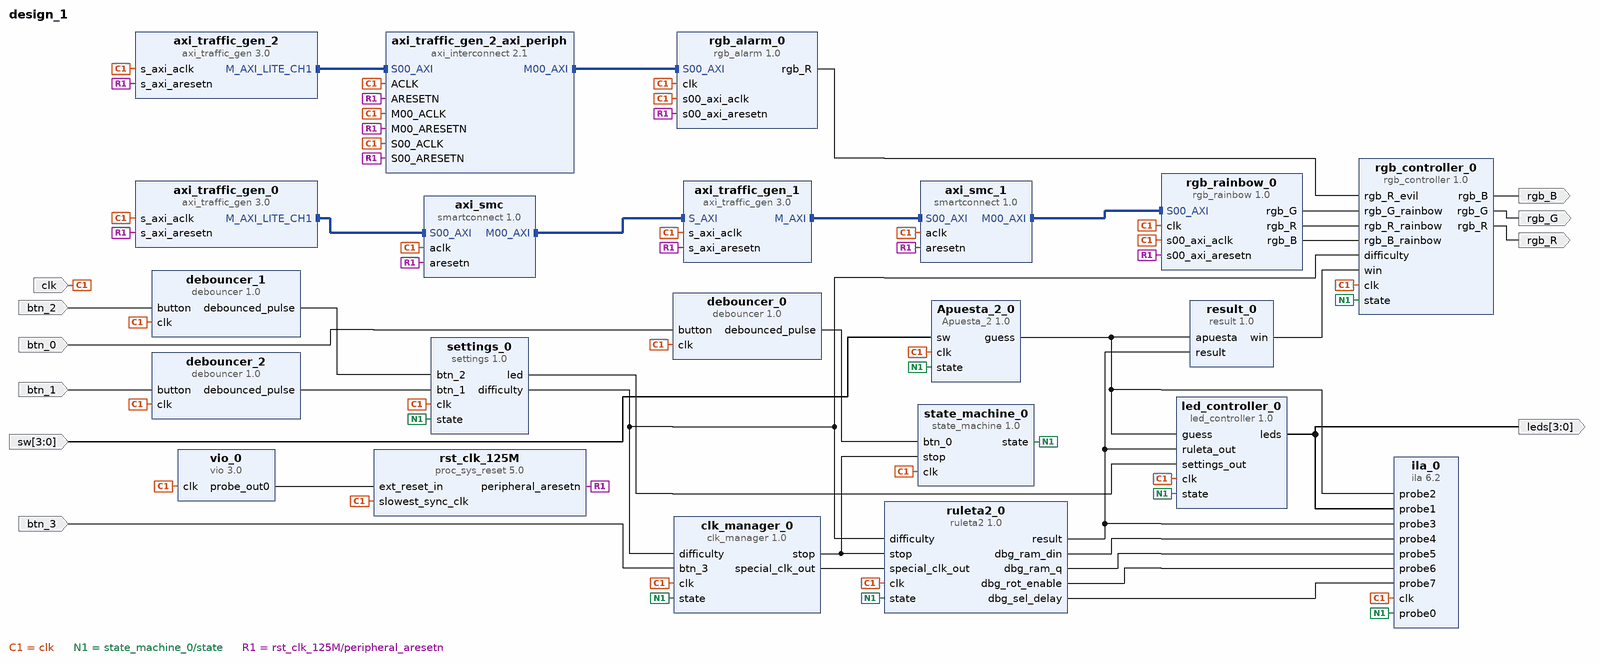
[diagram p0: block diagram of the top level]
# Vivado block design design_1, xc7z010clg400-1, Vivado 2020.1
create_bd_design design_1

create_bd_port -dir I -type clk clk
set_property -dict {CONFIG.FREQ_HZ 125000000} [get_bd_ports clk]
create_bd_port -dir I btn_1
create_bd_port -dir I btn_2
create_bd_port -dir I btn_0
create_bd_port -dir I btn_3
create_bd_port -dir O -from 3 -to 0 leds
create_bd_port -dir I -from 3 -to 0 sw
create_bd_port -dir O rgb_R
create_bd_port -dir O rgb_G
create_bd_port -dir O rgb_B

create_bd_cell -type ip -vlnv xilinx.com:user:state_machine:1.0 state_machine_0
create_bd_cell -type ip -vlnv xilinx.com:user:clk_manager:1.0 clk_manager_0
create_bd_cell -type ip -vlnv xilinx.com:user:settings:1.0 settings_0
create_bd_cell -type ip -vlnv xilinx.com:user:debouncer:1.0 debouncer_0
create_bd_cell -type ip -vlnv xilinx.com:user:debouncer:1.0 debouncer_1
create_bd_cell -type ip -vlnv xilinx.com:user:debouncer:1.0 debouncer_2
create_bd_cell -type ip -vlnv xilinx.com:ip:axi_traffic_gen:3.0 axi_traffic_gen_0
set_property -dict [list \
  CONFIG.C_ATG_MIF_DATA_DEPTH 64 \
  CONFIG.C_ATG_MODE AXI4-Lite \
  CONFIG.C_ATG_SYSINIT_MODES System_Test \
  CONFIG.C_ATG_SYSTEM_CMD_MAX_RETRY 2147483647 \
  CONFIG.C_ATG_SYSTEM_INIT_ADDR_MIF ../../../../../../../COE_Files/addr.coe \
  CONFIG.C_ATG_SYSTEM_INIT_CTRL_MIF ../../../../../../../COE_Files/ctrl.coe \
  CONFIG.C_ATG_SYSTEM_INIT_DATA_MIF ../../../../../../../COE_Files/data.coe \
  CONFIG.C_ATG_SYSTEM_INIT_MASK_MIF ../../../../../../../COE_Files/mask.coe \
] [get_bd_cells axi_traffic_gen_0]
create_bd_cell -type ip -vlnv xilinx.com:ip:axi_traffic_gen:3.0 axi_traffic_gen_1
create_bd_cell -type ip -vlnv xilinx.com:ip:smartconnect:1.0 axi_smc
set_property -dict {CONFIG.NUM_SI 1} [get_bd_cells axi_smc]
create_bd_cell -type ip -vlnv xilinx.com:ip:proc_sys_reset:5.0 rst_clk_125M
create_bd_cell -type ip -vlnv xilinx.com:ip:smartconnect:1.0 axi_smc_1
set_property -dict {CONFIG.NUM_SI 1} [get_bd_cells axi_smc_1]
create_bd_cell -type ip -vlnv xilinx.com:ip:vio:3.0 vio_0
set_property -dict {CONFIG.C_NUM_PROBE_IN 0} [get_bd_cells vio_0]
create_bd_cell -type ip -vlnv xilinx.com:ip:ila:6.2 ila_0
set_property -dict [list \
  CONFIG.C_ENABLE_ILA_AXI_MON false \
  CONFIG.C_MONITOR_TYPE Native \
  CONFIG.C_NUM_OF_PROBES 8 \
  CONFIG.C_PROBE0_WIDTH 2 \
  CONFIG.C_PROBE1_WIDTH 4 \
  CONFIG.C_PROBE2_WIDTH 4 \
  CONFIG.C_PROBE3_WIDTH 4 \
  CONFIG.C_PROBE4_WIDTH 4 \
  CONFIG.C_PROBE5_WIDTH 4 \
  CONFIG.C_PROBE7_WIDTH 2 \
] [get_bd_cells ila_0]
create_bd_cell -type ip -vlnv xilinx.com:ip:axi_traffic_gen:3.0 axi_traffic_gen_2
set_property -dict [list \
  CONFIG.C_ATG_MODE AXI4-Lite \
  CONFIG.C_ATG_SYSINIT_MODES System_Test \
  CONFIG.C_ATG_SYSTEM_CMD_MAX_RETRY 2147483647 \
  CONFIG.C_ATG_SYSTEM_INIT_ADDR_MIF ../../../../../../../COE_Files_2/addr.coe \
  CONFIG.C_ATG_SYSTEM_INIT_CTRL_MIF ../../../../../../../COE_Files_2/ctrl.coe \
  CONFIG.C_ATG_SYSTEM_INIT_DATA_MIF ../../../../../../../COE_Files_2/data.coe \
  CONFIG.C_ATG_SYSTEM_INIT_MASK_MIF ../../../../../../../COE_Files_2/mask.coe \
] [get_bd_cells axi_traffic_gen_2]
create_bd_cell -type ip -vlnv xilinx.com:ip:axi_interconnect:2.1 axi_traffic_gen_2_axi_periph
set_property -dict {CONFIG.NUM_MI 1} [get_bd_cells axi_traffic_gen_2_axi_periph]
create_bd_cell -type ip -vlnv xilinx.com:user:rgb_alarm:1.0 rgb_alarm_0
create_bd_cell -type ip -vlnv xilinx.com:user:result:1.0 result_0
create_bd_cell -type ip -vlnv xilinx.com:user:rgb_rainbow:1.0 rgb_rainbow_0
create_bd_cell -type ip -vlnv xilinx.com:user:led_controller:1.0 led_controller_0
create_bd_cell -type ip -vlnv xilinx.com:user:rgb_controller:1.0 rgb_controller_0
create_bd_cell -type ip -vlnv xilinx.com:user:Apuesta_2:1.0 Apuesta_2_0
create_bd_cell -type ip -vlnv xilinx.com:user:ruleta2:1.0 ruleta2_0

# ---- connections ----

connect_bd_intf_net [get_bd_intf_pins axi_traffic_gen_1/M_AXI] [get_bd_intf_pins axi_smc_1/S00_AXI]
connect_bd_intf_net [get_bd_intf_pins axi_traffic_gen_2_axi_periph/M00_AXI] [get_bd_intf_pins rgb_alarm_0/S00_AXI]
connect_bd_intf_net [get_bd_intf_pins axi_smc/M00_AXI] [get_bd_intf_pins axi_traffic_gen_1/S_AXI]
connect_bd_intf_net [get_bd_intf_pins axi_smc_1/M00_AXI] [get_bd_intf_pins rgb_rainbow_0/S00_AXI]
connect_bd_intf_net [get_bd_intf_pins axi_traffic_gen_0/M_AXI_LITE_CH1] [get_bd_intf_pins axi_smc/S00_AXI]
connect_bd_intf_net [get_bd_intf_pins axi_traffic_gen_2/M_AXI_LITE_CH1] [get_bd_intf_pins axi_traffic_gen_2_axi_periph/S00_AXI]
connect_bd_net -net clk_0_1 [get_bd_ports clk] \
  [get_bd_pins settings_0/clk] [get_bd_pins clk_manager_0/clk] [get_bd_pins state_machine_0/clk] \
  [get_bd_pins debouncer_2/clk] [get_bd_pins debouncer_1/clk] [get_bd_pins debouncer_0/clk] \
  [get_bd_pins axi_traffic_gen_0/s_axi_aclk] [get_bd_pins vio_0/clk] [get_bd_pins axi_traffic_gen_1/s_axi_aclk] \
  [get_bd_pins axi_smc/aclk] [get_bd_pins axi_smc_1/aclk] [get_bd_pins rst_clk_125M/slowest_sync_clk] [get_bd_pins ila_0/clk] \
  [get_bd_pins axi_traffic_gen_2/s_axi_aclk] [get_bd_pins axi_traffic_gen_2_axi_periph/S00_ACLK] \
  [get_bd_pins axi_traffic_gen_2_axi_periph/M00_ACLK] [get_bd_pins axi_traffic_gen_2_axi_periph/ACLK] \
  [get_bd_pins rgb_alarm_0/clk] [get_bd_pins rgb_alarm_0/s00_axi_aclk] [get_bd_pins rgb_rainbow_0/clk] \
  [get_bd_pins rgb_rainbow_0/s00_axi_aclk] [get_bd_pins led_controller_0/clk] [get_bd_pins rgb_controller_0/clk] \
  [get_bd_pins Apuesta_2_0/clk] [get_bd_pins ruleta2_0/clk]
connect_bd_net -net btn_3_0_1 [get_bd_ports btn_3] [get_bd_pins clk_manager_0/btn_3]
connect_bd_net [get_bd_pins state_machine_0/state] \
  [get_bd_pins clk_manager_0/state] [get_bd_pins settings_0/state] [get_bd_pins ila_0/probe0] \
  [get_bd_pins led_controller_0/state] [get_bd_pins rgb_controller_0/state] [get_bd_pins Apuesta_2_0/state] \
  [get_bd_pins ruleta2_0/state]
connect_bd_net [get_bd_pins led_controller_0/leds] [get_bd_ports leds] [get_bd_pins ila_0/probe1]
connect_bd_net -net apuesta_0_guess [get_bd_pins Apuesta_2_0/guess] \
  [get_bd_pins ila_0/probe2] [get_bd_pins result_0/apuesta] [get_bd_pins led_controller_0/guess]
connect_bd_net [get_bd_pins clk_manager_0/stop] [get_bd_pins state_machine_0/stop] [get_bd_pins ruleta2_0/stop]
connect_bd_net -net ruleta_0_result [get_bd_pins ruleta2_0/result] \
  [get_bd_pins ila_0/probe3] [get_bd_pins result_0/result] [get_bd_pins led_controller_0/ruleta_out]
connect_bd_net [get_bd_pins settings_0/difficulty] \
  [get_bd_pins clk_manager_0/difficulty] [get_bd_pins rgb_controller_0/difficulty] [get_bd_pins ruleta2_0/difficulty]
connect_bd_net -net btn_1_1 [get_bd_ports btn_1] [get_bd_pins debouncer_2/button]
connect_bd_net -net btn_2_1 [get_bd_ports btn_2] [get_bd_pins debouncer_1/button]
connect_bd_net -net btn_0_1 [get_bd_ports btn_0] [get_bd_pins debouncer_0/button]
connect_bd_net [get_bd_pins debouncer_0/debounced_pulse] [get_bd_pins state_machine_0/btn_0]
connect_bd_net [get_bd_pins debouncer_1/debounced_pulse] [get_bd_pins settings_0/btn_2]
connect_bd_net [get_bd_pins debouncer_2/debounced_pulse] [get_bd_pins settings_0/btn_1]
connect_bd_net [get_bd_pins rst_clk_125M/peripheral_aresetn] \
  [get_bd_pins axi_traffic_gen_0/s_axi_aresetn] [get_bd_pins axi_traffic_gen_1/s_axi_aresetn] [get_bd_pins axi_smc/aresetn] \
  [get_bd_pins axi_smc_1/aresetn] [get_bd_pins axi_traffic_gen_2/s_axi_aresetn] \
  [get_bd_pins axi_traffic_gen_2_axi_periph/S00_ARESETN] [get_bd_pins axi_traffic_gen_2_axi_periph/M00_ARESETN] \
  [get_bd_pins axi_traffic_gen_2_axi_periph/ARESETN] [get_bd_pins rgb_alarm_0/s00_axi_aresetn] \
  [get_bd_pins rgb_rainbow_0/s00_axi_aresetn]
connect_bd_net [get_bd_pins vio_0/probe_out0] [get_bd_pins rst_clk_125M/ext_reset_in]
connect_bd_net [get_bd_pins settings_0/led] [get_bd_pins led_controller_0/settings_out]
connect_bd_net [get_bd_pins rgb_controller_0/rgb_G] [get_bd_ports rgb_G]
connect_bd_net [get_bd_pins rgb_controller_0/rgb_R] [get_bd_ports rgb_R]
connect_bd_net [get_bd_pins rgb_controller_0/rgb_B] [get_bd_ports rgb_B]
connect_bd_net [get_bd_pins rgb_rainbow_0/rgb_G] [get_bd_pins rgb_controller_0/rgb_G_rainbow]
connect_bd_net [get_bd_pins rgb_rainbow_0/rgb_R] [get_bd_pins rgb_controller_0/rgb_R_rainbow]
connect_bd_net [get_bd_pins rgb_rainbow_0/rgb_B] [get_bd_pins rgb_controller_0/rgb_B_rainbow]
connect_bd_net [get_bd_pins rgb_alarm_0/rgb_R] [get_bd_pins rgb_controller_0/rgb_R_evil]
connect_bd_net [get_bd_pins result_0/win] [get_bd_pins rgb_controller_0/win]
connect_bd_net [get_bd_ports sw] [get_bd_pins Apuesta_2_0/sw]
connect_bd_net [get_bd_pins clk_manager_0/special_clk_out] [get_bd_pins ruleta2_0/special_clk_out]
connect_bd_net [get_bd_pins ruleta2_0/dbg_ram_din] [get_bd_pins ila_0/probe4]
connect_bd_net [get_bd_pins ruleta2_0/dbg_ram_q] [get_bd_pins ila_0/probe5]
connect_bd_net [get_bd_pins ruleta2_0/dbg_rot_enable] [get_bd_pins ila_0/probe6]
connect_bd_net [get_bd_pins ruleta2_0/dbg_sel_delay] [get_bd_pins ila_0/probe7]

# ---- address map ----
assign_bd_address -offset 0x44A00000 -range 64K -target_address_space [get_bd_addr_spaces axi_traffic_gen_0/Reg1] [get_bd_addr_segs axi_traffic_gen_1/S_AXI/Reg0]
assign_bd_address -offset 0x76000000 -range 64K -target_address_space [get_bd_addr_spaces axi_traffic_gen_1/Data] [get_bd_addr_segs rgb_rainbow_0/S00_AXI/S00_AXI_mem]
assign_bd_address -offset 0x44A00000 -range 64K -target_address_space [get_bd_addr_spaces axi_traffic_gen_2/Reg1] [get_bd_addr_segs rgb_alarm_0/S00_AXI/S00_AXI_reg]

validate_bd_design
save_bd_design
